# EAGLE schematic ePaperShoe (EAGLE 8.4.2)

## Sheet 1 of 2
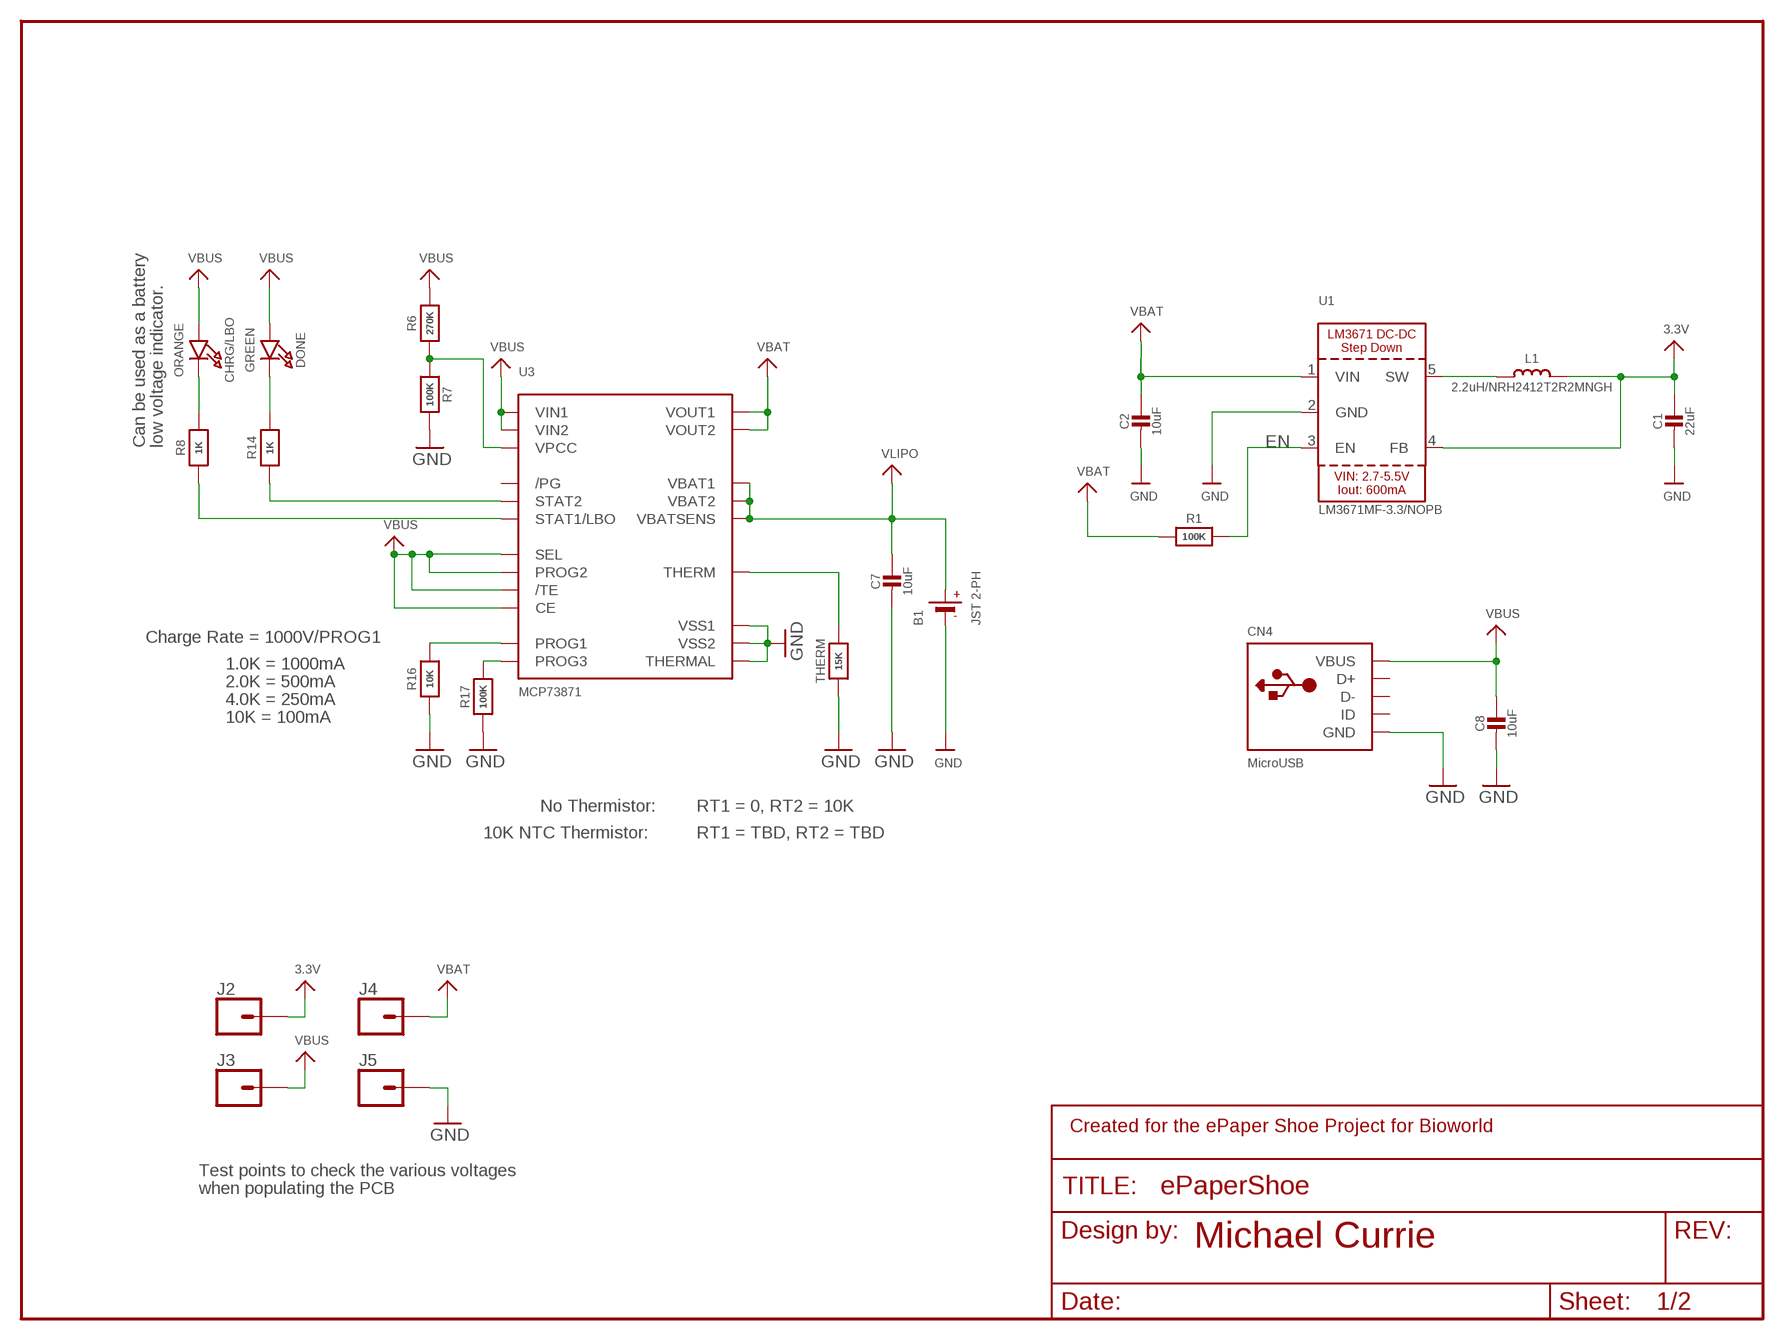
[diagram p0: schematic, sheet 1]

### Parts
B1  JST 2-PH  BATTERY  [JSTPH2]
C1  22uF  CAP_CERAMIC0805-NOOUTLINE  [0805-NO]
C2  10uF  CAP_CERAMIC0805-NOOUTLINE  [0805-NO]
C7  10uF  CAP_CERAMIC0805-NOOUTLINE  [0805-NO]
C8  10uF  CAP_CERAMIC0805-NOOUTLINE  [0805-NO]
CHRG/LBO  ORANGE  LED0805_NOOUTLINE  [CHIPLED_0805_NOOUTLINE]
CN4  MicroUSB  USBMICRO_20329  [4UCONN_20329]
DONE  GREEN  LED0805_NOOUTLINE  [CHIPLED_0805_NOOUTLINE]
FRAME1  FRAME-LETTER-MICHAELNO_PACKAGE  [DUMMY]
J2  CONN_01  [1X01]
J3  CONN_01  [1X01]
J4  CONN_01  [1X01]
J5  CONN_01  [1X01]
L1  2.2uH/NRH2412T2R2MNGH  INDUCTORNRH2412T  [INDUCTOR_TAIYOYUDEN_NRH2412T]
R1  100K  RESISTOR0805_NOOUTLINE  [0805-NO]
R6  270K  RESISTOR0805_NOOUTLINE  [0805-NO]
R7  100K  RESISTOR0805_NOOUTLINE  [0805-NO]
R8  1K  RESISTOR0805_NOOUTLINE  [0805-NO]
R14  1K  RESISTOR0805_NOOUTLINE  [0805-NO]
R16  10K  RESISTOR0805_NOOUTLINE  [0805-NO]
R17  100K  RESISTOR0805_NOOUTLINE  [0805-NO]
THERM  15K  RESISTOR0805_NOOUTLINE  [0805-NO]
U1  LM3671MF-3.3/NOPB  VREG_LM3671  [SOT23-5]
U3  MCP73871  [QFN20_4MM]

### Nets
3.3V: C1.1 J2.1 L1.2 U1.4(FB) ; also sheet 2
EN: R1.2 U1.3(EN)
GND: B1.1(-) C1.2 C2.2 C7.2 C8.2 CN4.BASE@1(GND) CN4.BASE@2(GND) CN4.GND CN4.SPRT@1(GND) CN4.SPRT@2(GND) CN4.SPRT@3(GND) CN4.SPRT@4(GND) J5.1 R7.2 R16.1 R17.1 THERM.1 U1.2(GND) U3.P$10(VSS1) U3.P$11(VSS2) U3.P$21(THERMAL) ; also sheet 2
N$1: L1.1 U1.5(SW)
N$7: R6.1 R7.1 U3.P$2(VPCC)
N$8: DONE.C R14.2
N$9: R14.1 U3.P$7(STAT2)
N$10: THERM.2 U3.P$5(THERM)
N$11: R8.1 U3.P$8(STAT1/LBO)
N$12: CHRG/LBO.C R8.2
N$13: R17.2 U3.P$12(PROG3)
N$16: R16.2 U3.P$13(PROG1)
VBAT: C2.1 J4.1 R1.1 U1.1(VIN) U3.P$1(VOUT1) U3.P$20(VOUT2)
VBUS: C8.1 CHRG/LBO.A CN4.VBUS DONE.A J3.1 R6.2 U3.P$3(SEL) U3.P$4(PROG2) U3.P$9(/TE) U3.P$17(CE) U3.P$18(VIN1) U3.P$19(VIN2)
VLIPO: B1.2(+) C7.1 U3.P$14(VBAT1) U3.P$15(VBAT2) U3.P$16(VBATSENS)
Unconnected: CN4.D+ CN4.D- CN4.ID U3.P$6(/PG)

### Notes on the sheet
- Can be used as a battery | low voltage indicator.
- Charge Rate = 1000V/PROG1
- 1.0K = 1000mA
- 2.0K = 500mA
- 4.0K = 250mA
- 10K = 100mA
- No Thermistor: | RT1 = 0, RT2 = 10K
- 10K NTC Thermistor: | RT1 = TBD, RT2 = TBD
- Test points to check the various voltages
- when populating the PCB

## Sheet 2 of 2
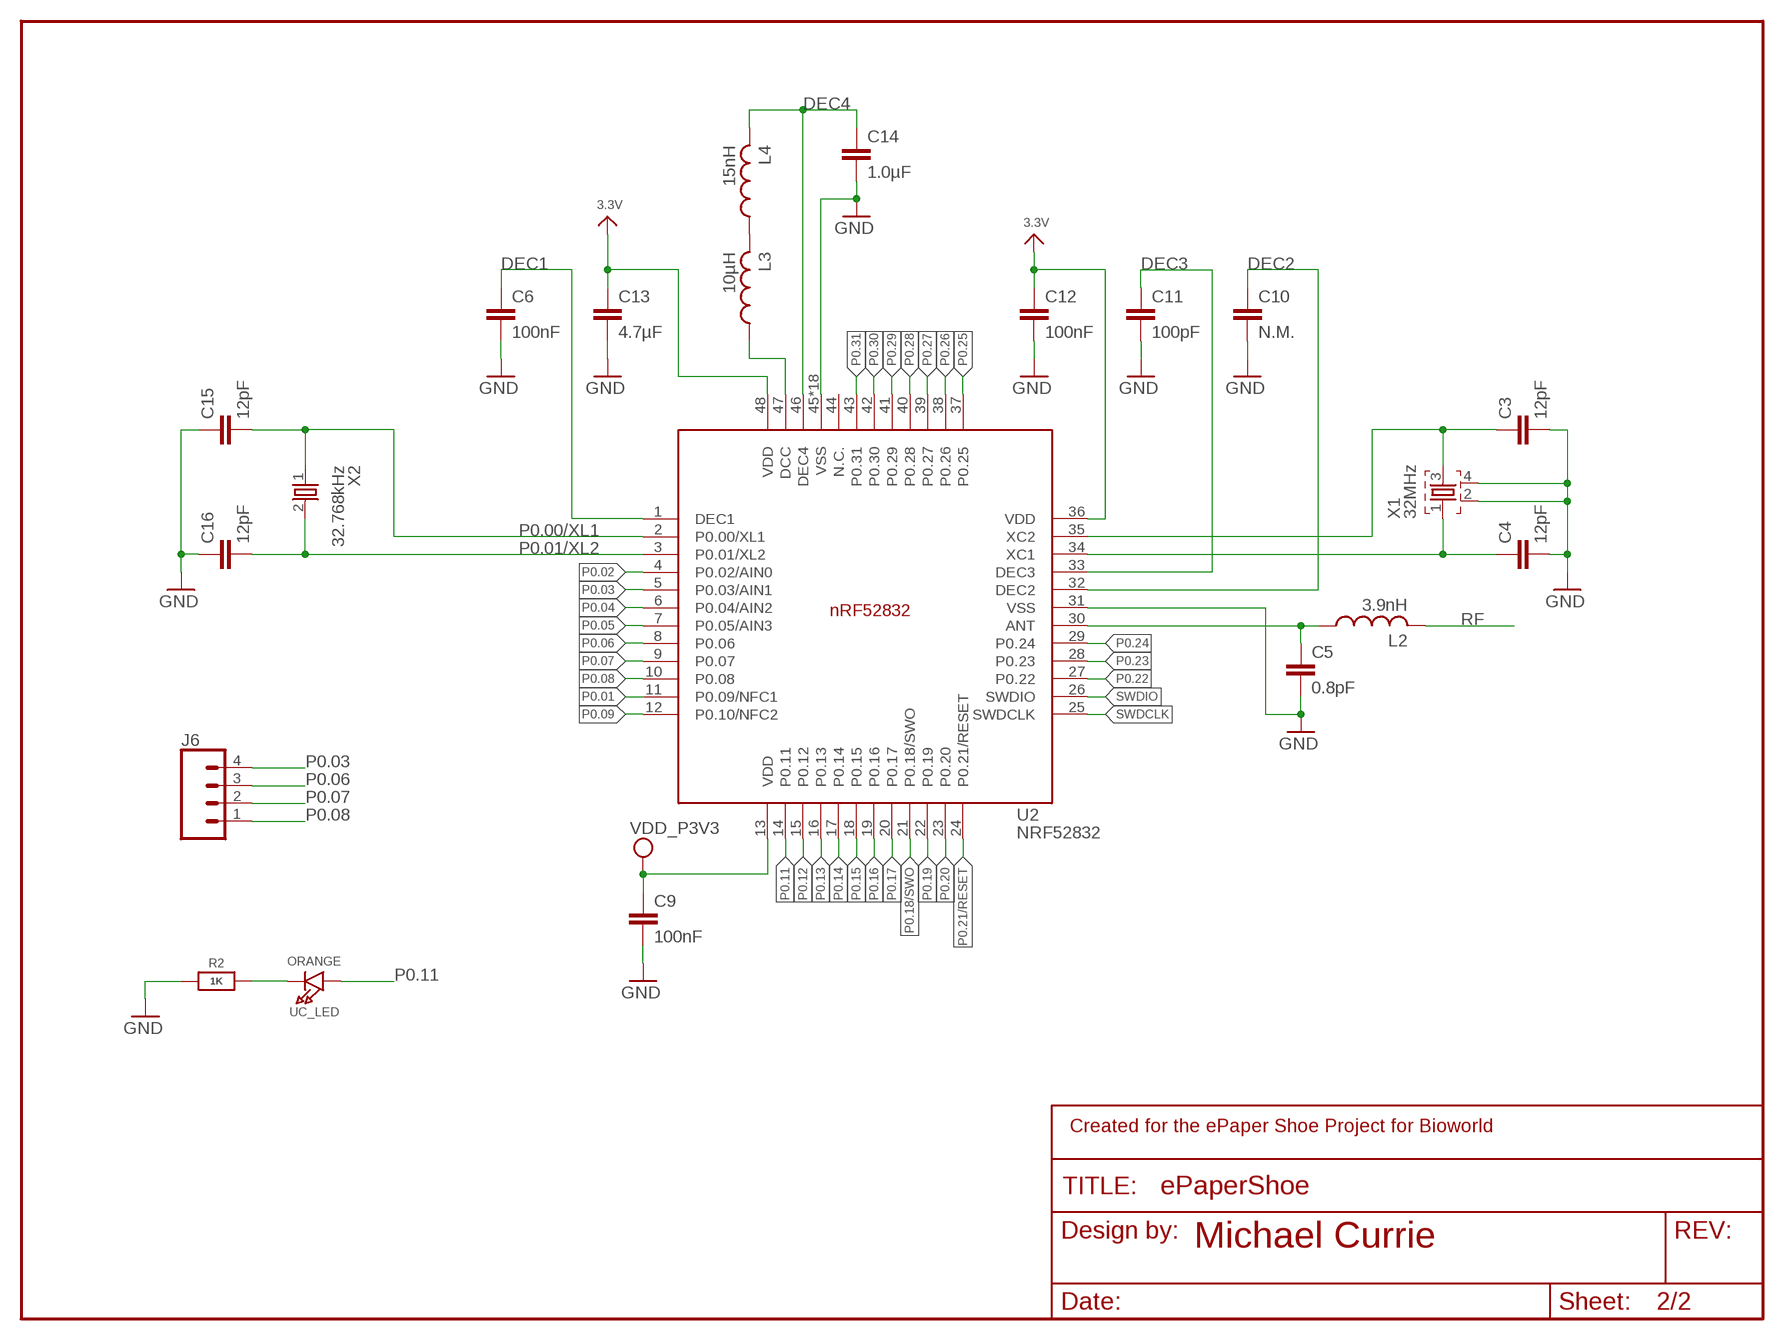
[diagram p1: schematic, sheet 2]

### Parts
C3  12pF  CAPACITOR_0402_N  [RESC0402_N]
C4  12pF  CAPACITOR_0402_N  [RESC0402_N]
C5  0.8pF  CAPACITOR_0402_N  [RESC0402_N]
C6  100nF  CAPACITOR_0402_N  [RESC0402_N]
C9  100nF  CAPACITOR_0402_N  [RESC0402_N]
C10  N.M.  CAPACITOR_0402_N  [RESC0402_N]
C11  100pF  CAPACITOR_0402_N  [RESC0402_N]
C12  100nF  CAPACITOR_0402_N  [RESC0402_N]
C13  4.7µF  CAPACITOR_0603_N  [RESC0603_N]
C14  1.0µF  CAPACITOR_0603_N  [RESC0603_N]
C15  12pF  CAPACITOR_0402_N  [RESC0402_N]
C16  12pF  CAPACITOR_0402_N  [RESC0402_N]
FRAME2  FRAME-LETTER-MICHAELNO_PACKAGE  [DUMMY]
J6  CONN_04  [1X04]
L2  3.9nH  INDUCTOR_0402_N  [RESC0402_N]
L3  10µH  INDUCTOR_0603_N  [RESC0603_N]
L4  15nH  INDUCTOR_0402_N  [RESC0402_N]
R2  1K  RESISTOR0805_NOOUTLINE  [0805-NO]
U2  NRF52832  [QFN40P600X600X90-48_N]
UC_LED  ORANGE  LED0805_NOOUTLINE  [CHIPLED_0805_NOOUTLINE]
X1  32MHz  XTAL_32MHZ  [BT-XTAL_2016_N]
X2  32.768kHz  XTAL_32KHZ  [XTAL_3215_N]

### Nets
3.3V: C12.1 C13.1 U2.36(VDD) U2.48(VDD) ; also sheet 1
ANT: C5.1 L2.1 U2.30(ANT)
DEC1: C6.1 U2.1(DEC1)
DEC2: C10.1 U2.32(DEC2)
DEC3: C11.1 U2.33(DEC3)
DEC4: C14.1 L4.2 U2.46(DEC4)
GND: C3.2 C4.2 C5.2 C6.2 C9.2 C10.2 C11.2 C12.2 C13.2 C14.2 C15.1 C16.1 R2.1 U2.31(VSS) U2.45(VSS) U2.PAD(VSS) U2.PAD@VIA01(VSS) U2.PAD@VIA02(VSS) U2.PAD@VIA03(VSS) U2.PAD@VIA04(VSS) U2.PAD@VIA05(VSS) U2.PAD@VIA06(VSS) U2.PAD@VIA07(VSS) U2.PAD@VIA08(VSS) U2.PAD@VIA09(VSS) U2.PAD@VIA10(VSS) U2.PAD@VIA11(VSS) U2.PAD@VIA12(VSS) U2.PAD@VIA13(VSS) U2.PAD@VIA14(VSS) U2.PAD@VIA15(VSS) U2.PAD@VIA16(VSS) X1.2 X1.4 ; also sheet 1
N$3: C3.1 U2.35(XC2) X1.3
N$4: L3.2 L4.1
N$5: L3.1 U2.47(DCC)
N$15: R2.2 UC_LED.C
P0.00/XL1: C15.2 U2.2(P0.00/XL1) X2.1
P0.01: U2.11(P0.09/NFC1)
P0.01/XL2: C16.2 U2.3(P0.01/XL2) X2.2
P0.02: U2.4(P0.02/AIN0)
P0.03: J6.4 U2.5(P0.03/AIN1)
P0.04: U2.6(P0.04/AIN2)
P0.05: U2.7(P0.05/AIN3)
P0.06: J6.3 U2.8(P0.06)
P0.07: J6.2 U2.9(P0.07)
P0.08: J6.1 U2.10(P0.08)
P0.09: U2.12(P0.10/NFC2)
P0.11: U2.14(P0.11) UC_LED.A
P0.12: U2.15(P0.12)
P0.13: U2.16(P0.13)
P0.14: U2.17(P0.14)
P0.15: U2.18(P0.15)
P0.16: U2.19(P0.16)
P0.17: U2.20(P0.17)
P0.18/SWO: U2.21(P0.18/SWO)
P0.19: U2.22(P0.19)
P0.20: U2.23(P0.20)
P0.21/RESET: U2.24(P0.21/RESET)
P0.22: U2.27(P0.22)
P0.23: U2.28(P0.23)
P0.24: U2.29(P0.24)
P0.25: U2.37(P0.25)
P0.26: U2.38(P0.26)
P0.27: U2.39(P0.27)
P0.28: U2.40(P0.28)
P0.29: U2.41(P0.29)
P0.30: U2.42(P0.30)
P0.31: U2.43(P0.31)
RF: L2.2
SWDCLK: U2.25(SWDCLK)
SWDIO: U2.26(SWDIO)
VDD_P3V3: C9.1 U2.13(VDD)
X1: C4.1 U2.34(XC1) X1.1
Unconnected: U2.44(N.C.)

## Library data of the parts
B1 = microbuilder:BATTERY: CR1220 SMT - Digikey: 3001K-ND CD2032 BAT-HLD-001 - Digikey: BAT-HLD-001-ND
C1 C2 C7 C8 = microbuilder:CAP_CERAMIC: Ceramic Capacitors For new designs, use the packages preceded by an '_' character since they are more reliable: The following footprints should be used on most boards: _0402 - Standard footprint for regular board layouts _0603 - Standard footprint for regular board layouts _0805 - Standard footprint for regular board layouts _1206 - Standard footprint for regular board layouts For extremely tight-pitch boards where space is at a premium, the following 'micro-pitch' footprints can be used (smaller pads, no silkscreen outline, etc.): _0402MP - Micro-pitch footprint for very dense/compact boards _0603MP - Micro-pitch footprint for very dense/compact boards _0805MP - Micro-pitch footprint for very dense/compact boards _1206MP - Micro-pitch footprint for very dense/compact boards
C3-C6 C9-C16 = Nordic_nRF:CAPACITOR: Generic chip capacitor
CHRG/LBO DONE UC_LED = microbuilder:LED: LED 0603 - 0603 Surface Mount Package 2mA: Green LED - Low Power (3.9mcd, 2ma, 1.7Vf) - Digikey: 475-2709-2-ND Orange LED - Low Power (9.8mcd, 2ma, 1.8Vf) - Digikey: 475-1194-2-ND Red LED - Low Power (5mcd, 2ma, 1.8Vf) - Digikey: 475-1195-2-ND Yellow LED - Low Power (7mcd, 2ma, 1.8Vf) - Digikey: 475-1196-2-ND 5mA: Blue LED - Low Power (17mcd, 5ma, 2.9Vf) - Digikey: LNJ937W8CRACT-ND 0805 - 0805 Surface Mount Package 2mA: Red LED (8.8mcd, 2mA, 1.8Vf, Clear) - Low Power [Digikey: 475-2510-1-ND] Green LED (5mcd, 2mA, 1.8Vf, Clear) - Low Power [Digikey: 475-2730-1-ND] Yellow LED (11.3mcd, 2mA, 1.8Vf, Clear) - Low Power [Digikey: 475-2555-1-ND] 20mA: Red LED (104mcd, 20mA, Diffused) - LS R976 [Digikey: 475-1278-6-ND] Red LED (12mcd, 20mA, 2.0Vf, Clear) - APT2012EC [Digikey: 754-1128-1-ND] Green LED (15mcd, 20mA, 2.2Vf, Clear) - APT2012GC [Digikey: 754-1131-1-ND] Orange LED (160mcd, 20mA, 2.1Vf, Clear) - APT2012SECK [Digikey: 754-1130-1-ND] 1206 - 1206 Surface Mount Package Green LED (26mcd, 20mA, Diffused) - LG N971 [Digikey: 475-1407-6-ND] Red LED (15mcd, 20mA, Diffused) - LH N974 [Digikey: 475-1416-6-ND] Cree - Cree High-Power Surface Mount LEDs XPEBWT-L1-0000-00D50 - White 111lm 350mA 2.9Vf 6200K 110�° XTEAWT-00-0000-00000LEE3 - White 114lm 350mA 2.85Vf 5000K 115�° Everlight - Everlight 45-21 Series Surface Mount LEDs 45-21/QK2C-B2832AC2CB2/2T - Warm White 2000mcd 20mA 3.25Vf 3050K 120�° 45-21/LK2C-B38452C4CB2/2T - Nuetral White 2000mcd 20mA 3.25Vf 4150K 120�° 45-21/LK2C-B50634C6CB2/2T - Cold White 2200mcd 20mA 3.25Vf 5650K 120�° PLCC2 Reverse Mount LS T77K-J1L2-1-0-2-R18-Z - Red 11.25mcd 2mA 1.8Vf 630nm 120�° LO T77K-L1M2-24-Z - Orange 19.6mcd 2mA 1.8Vf 606nm 120�° LY T77K-K2M1-26-Z - Yellow 15.7mcd 2mA 1.8Vf 587nm 120�°
CN4 = microbuilder:USB: USB Connectors USBMINIB - Surface Mount Female Mini-B USB Connector 4UConnector: 06564
FRAME1 FRAME2 = SparkFun-Aesthetics:FRAME-LETTER-MICHAEL: Schematic Frame - Letter Standard 8.5x11 US Letter frame; DESIGNER: Nobody; VERSION: v01
J2-J5 = SparkFun-Connectors:CONN_01: Single connection point. Often used as Generic Header-pin footprint for 0.1 inch spaced/style header connections On any of the 0.1 inch spaced packages, you can populate with these: Break Away Headers - Straight <https://www.sparkfun.com/products/116> (PRT-00116) Break Away Male Headers - Right Angle <https://www.sparkfun.com/products/553> (PRT-00553) Female Headers <https://www.sparkfun.com/products/115> (PRT-00115) Break Away Headers - Machine Pin <https://www.sparkfun.com/products/117> (PRT-00117) Break Away Female Headers - Swiss Machine Pin <https://www.sparkfun.com/products/743> (PRT-00743) This device is also useful as a general connection point to wire up your design to another part of your project. Our various solder wires solder well into these plated through hole pads. Hook-Up Wire - Assortment (Stranded, 22 AWG) <https://www.sparkfun.com/products/11375> (PRT-11375) Hook-Up Wire - Assortment (Solid Core, 22 AWG) <https://www.sparkfun.com/products/11367> (PRT-11367) View the entire wire category on our website here <https://www.sparkfun.com/categories/141> Special notes: SMTSO-256-ET is a "flush mount" nut for a 4-40 screw. We mostly use this on specialty testbeds; it is a nice way to connect hardware to your PCB at an adjustable hieght. Also note, the SNAP packages are for using a snappable style connector. We sell a baggie of snaps and they are also used on two LilyPad designs: Snap Assortment - 30 pack (male and female) <https://www.sparkfun.com/products/11347> (DEV-11347) LilyPad Arduino SimpleSnap <https://www.sparkfun.com/products/10941> (DEV-10941) LilyPad SimpleSnap Protoboard <https://www.sparkfun.com/products/10940> (DEV-10940)
J6 = SparkFun-Connectors:CONN_04: Multi connection point. Often used as Generic Header-pin footprint for 0.1 inch spaced/style header connections On any of the 0.1 inch spaced packages, you can populate with these: Break Away Headers - Straight <https://www.sparkfun.com/products/116> (PRT-00116) Break Away Male Headers - Right Angle <https://www.sparkfun.com/products/553> (PRT-00553) Female Headers <https://www.sparkfun.com/products/115> (PRT-00115) Break Away Headers - Machine Pin <https://www.sparkfun.com/products/117> (PRT-00117) Break Away Female Headers - Swiss Machine Pin <https://www.sparkfun.com/products/743> (PRT-00743) For SCREWTERMINALS and SPRING TERMINALS visit here: Screw Terimnals on SparkFun.com <https://www.sparkfun.com/search/results?term=Screw+Terminals> (5mm/3.5mm/2.54mm spacing) This device is also useful as a general connection point to wire up your design to another part of your project. Our various solder wires solder well into these plated through hole pads. Hook-Up Wire - Assortment (Stranded, 22 AWG) <https://www.sparkfun.com/products/11375> (PRT-11375) Hook-Up Wire - Assortment (Solid Core, 22 AWG) <https://www.sparkfun.com/products/11367> (PRT-11367) View the entire wire category on our website here <https://www.sparkfun.com/categories/141> Special notes: Molex polarized connector foot print use with SKU : PRT-08231 with associated crimp pins and housings. 1MM SMD Version SKU: PRT-10208; PROD_ID: CONN-09696
L1 = microbuilder:INDUCTOR: Inductors 0603: 10nH Ceramic Inductor - microwire antenna/RF (Digikey: 712-1434-2-ND) 0805: 560nH Ceramic Inductor - RF (Digikey: 553-1047-1-ND) 270nH Ceramic Inductor - Q = 40@250MHz, +-5%, 1 Ohm DC Resistance (Digikey: 535-10506-2-ND) 1007 (2518 Metric) SMT: 10µH 10% 250mOhm 820mA 1007 Inductor (Digikey: 587-2189-1-ND) 22µH 10% 500mOhm 580mA 1007 Inductor (Digikey: 587-2190-1-ND) 47µH 10% 950mOhm 420mA 1007 Inductor (Digikey: 587-2191-1-ND) 47µH 5% 100mOhm 1A 1008 Inductor (Digikey: 732-1816-1-ND) 5.0x5.0mm (Taiyo Yuden NR5040 Series) 6.8µH 20% 2.3A 64mOhm Inductor (Digikey: 587-2374-2-ND) 5.0x5.0mm (TDK VLC5045 Series) 4.7µH 20% 3.3A 34mOhm Inductor (Digikey: 445-6526-1-ND) 6.8µH 20% 2.7A 46mOhm Inductor (Digikey: 445-6527-1-ND) 6.0x6.0mm (TDK VLC6045 Series) 4.7µH 20% 3.8A 27mOhm Inductor (Digikey: 445-6538-2-ND) 6.8µH 20% 3A 41mOhm Inductor (Digikey: 445-6540-1-ND) 6.2µH 30% 2.2A 45mOhm Inductor (Digikey: SRR5028-6R2YCT-ND) - Not TDK VLC6045 but footprint should match 6.0x6.0mm (TDK SLF6045 Series) 6.8uH 30% 2A 33mOhm Inductor (Digikey: 445-4572-1-ND, Mouser: 810-SLF645T6R8N2R0PF) 6.0x6.0mm (Sumida CDRH5D28 Series) 6.2uH 30% 1.8A 45mOhm Inductor (Digikey: 308-1542-1-ND) Taiyo Yuden NR3015T2R2M - 2.2uH 20% 1.5A (Digikey: 587-1648-2-ND, Mouser: 963-NR3015T2R2M) - Used with TI TPS62172 CoilCraft RFID Transponder Coil - MA5532-AE (For use with AS3935 Lightning Sensor) Taiyo Yuden NRH2412T2R2MNGH - 2.2uH 20% 1AA (Digikey: 587-3443-1-ND) - Used with TI LM3671 Vishay IHLP 1.0uH Molded Inductor - 24mOhm DCR, 5A, +/-20%, -55°C-125°C (Digikey: 541-1319-1-ND)
L2-L4 = Nordic_nRF:INDUCTOR: Generic chip inductor
R1 R2 R6-R8 R14 R16 R17 THERM = microbuilder:RESISTOR: Resistors For new designs, use the packages preceded by an '_' character since they are more reliable: The following footprints should be used on most boards: _0402 - Standard footprint for regular board layouts _0603 - Standard footprint for regular board layouts _0805 - Standard footprint for regular board layouts _1206 - Standard footprint for regular board layouts For extremely tight-pitch boards where space is at a premium, the following 'micro-pitch' footprints can be used (smaller pads, no silkscreen outline, etc.): _0402MP - Micro-pitch footprint for very dense/compact boards _0603MP - Micro-pitch footprint for very dense/compact boards _0805MP - Micro-pitch footprint for very dense/compact boards _1206MP - Micro-pitch footprint for very dense/compact boards
U1 = microbuilder:VREG_LM3671: LM3671 - 600mA DC-DC Step-Down Converter VIN: 2.7-5.5V Load Current: 600mA Switching Frequency: 2MHz Iq: 16uA
U2 = Nordic_nRF:NRF52832: nRF52832 Features Single chip, highly flexible, 2.4 GHz multi-protocol SoC 32-bit ARM Cortex-M4F Processor 1.7v to 3.6v operation 512kB flash + 64kB RAM Supports concurrent Bluetooth Smart/ANT protocol operation On-chip NFC tag for Out-of-Band (OOB) pairing Up to +4dBm output power -96dBm sensitivity, Bluetooth Smart Thread safe and run-time protected Event driven API On air compatible with nRF24L and nRF24AP series 2 data rates (2Mbps/1Mbps) PPI - maximum flexibility for power-efficient applications and code simplification Automated power management system with automatic power management of each peripheral Configurable I/O mapping for analog and digital I/O 3 x Master/Slave SPI 2 x Two-wire interface (I²C) UART (RTS/CTS) 3 x PWM AES HW encryption Real Time Counter (RTC) Digital microphone interface (PDM) On-chip balun Applications Internet of Things (IoT) Wearables SmartHome sensors Connected white goods Computer peripherals Voice-command smart remotes A4WP ‘Rezence’ wireless charging Beacons Sports and fitness sensors and hubs Connected health products Smart watches RC Toys Interactive games Building automation and sensor networks
U3 = microbuilder:MCP73871: MCP73871 Lithium Polymer Battery Charger Digikey: MCP73871-2CCI/ML-ND
X1 = Nordic_nRF:XTAL_32MHZ
X2 = Nordic_nRF:XTAL_32KHZ